# Altium project Nixie_Clock.PrjPcb
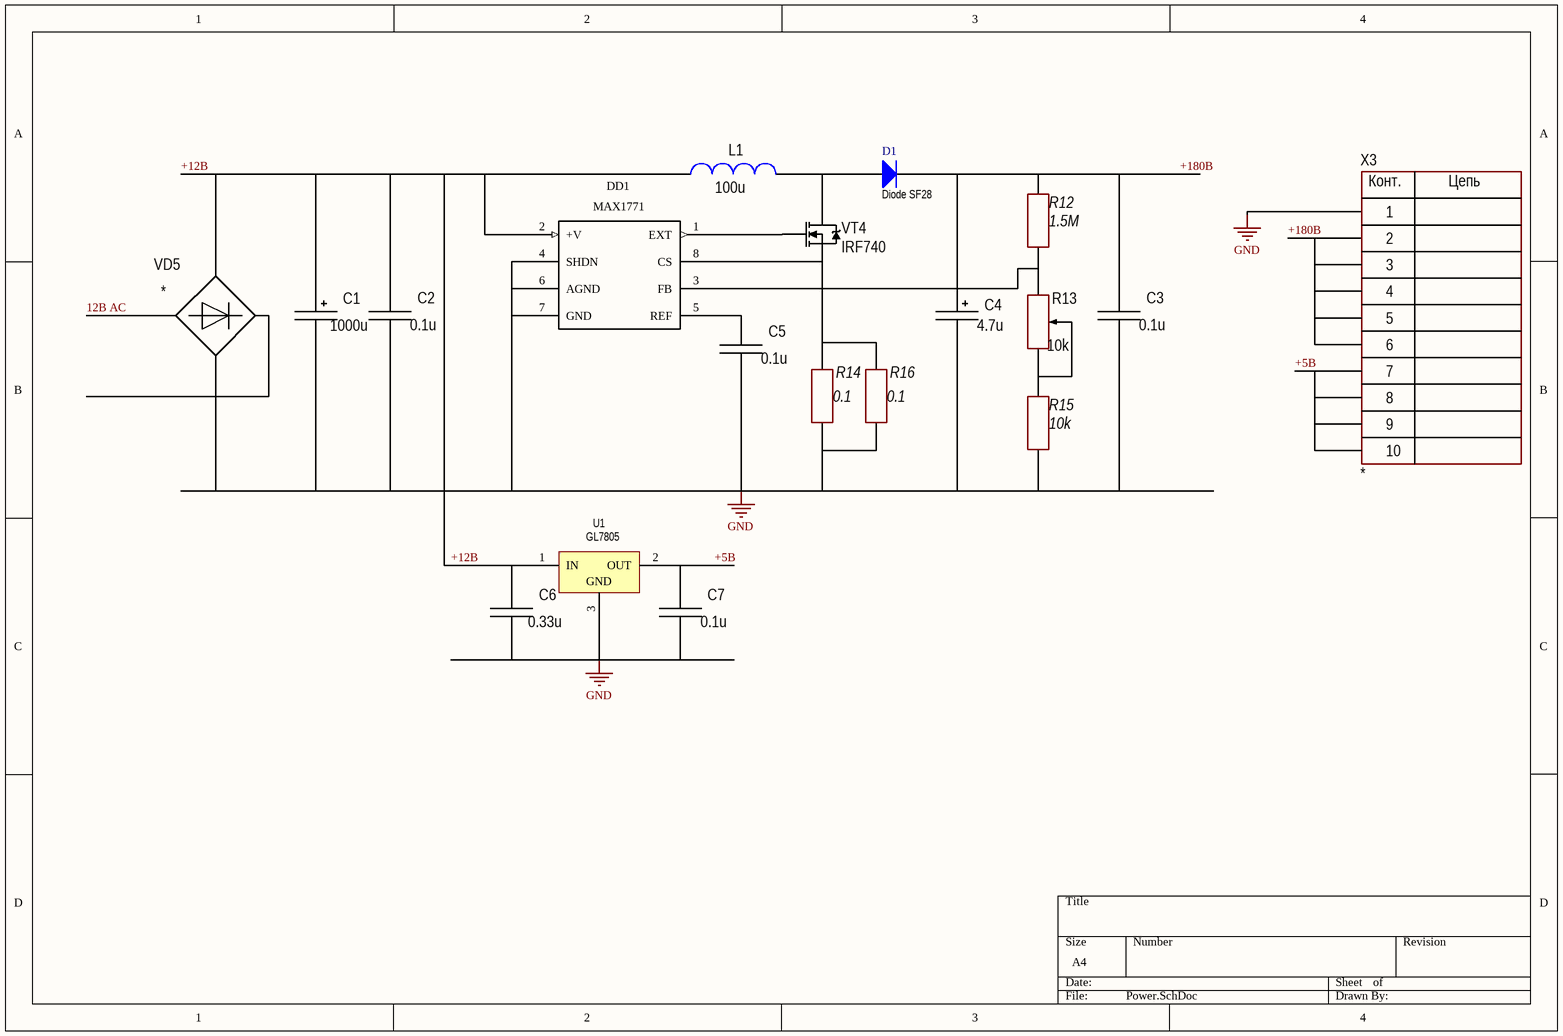
[diagram p0: Power.SchDoc]
5 sheets, 110 parts. Net scope: global (net labels, ports and power ports of the same name join across sheets).
Board files: Power.PcbDoc, Control.PcbDoc, Cross.PcbDoc, Power_2.PcbDoc, RGB_plate.PcbDoc, RGB_attiny2313.PcbDoc
Sheets:
  Power.SchDoc
  Control.SchDoc
  Cross.SchDoc
  Power_2.SchDoc
  RGB_attiny2313.SchDoc

## Sheet Power.SchDoc
size A4

### Parts
C1  1000u  [D5C2H11]
C2  0.1u  [CAP: DEBB33D]
C3  0.1u  [CAP: DEBB33D]
C4  4.7u  [D8C3.5H12]
C5  0.1u  [CAP: DEBB33D]
C6  0.33u  [CAP: DEBB33D]
C7  0.1u  [CAP: DEBB33D]
D1  Diode SF28  [DO-201AD]
DD1  MAX1771  [MAX1771_DIP8 - duplicate]
L1  100u  [IND: SRU1048]
R12  1.5M  [MLT]
R13  10k  [RES: 3296W]
R14  0.1  [MLT]
R15  10k  [MLT]
R16  0.1  [MLT]
U1  GL7805  [TO220VW]
VD5  *  [DIOD: DF206S-G]
VT4  IRF740  [TO220_123_H]
X3  *  [CON: S10B-PHD]

### Nets
GND: C1.2 C2.2 C3.2 C4.2 C5.2 C6.2 C7.2 DD1.4(SHDN) DD1.6(AGND) DD1.7(GND) R14.1 R15.2 R16.1 U1.3(GND) VD5.4 X3.1
12В AC: VD5.1
+5В: C7.1 U1.2(OUT) X3.7 X3.8 X3.9 X3.10
+12В: C1.1 C2.1 C6.1 DD1.2(+V) L1.2 U1.1(IN) VD5.2
+180В: C3.1 C4.1 D1.2(K) R12.1 X3.2 X3.3 X3.4 X3.5 X3.6
NetC5_1: C5.1 DD1.5(REF)
NetD1_1: D1.1(A) L1.1 VT4.2(D)
NetDD1_1: DD1.1(EXT) VT4.1(G)
NetDD1_3: DD1.3(FB) R12.2 R13.1
NetDD1_8: DD1.8(CS) R14.2 R16.2 VT4.3(S)
NetR13_2: R13.2 R13.3 R15.1

Not connected (* = marked no-connect by the designer): VD5 3

### Notes on the sheet
- (in symbol 10-Connector) Конт.; Цепь

### Library data of the parts
C1 C4 = AlumCap: Manufacturer: *; Model: *; HelpURL: *; ComponentKind: *; Value: *
C2 C3 C5-C7 = Capacitor: Manufacturer: *; Model: *; HelpURL: *; ComponentKind: *; Value: *
D1 = Diode 1N5402: 3 Amp General Purpose Rectifier; Published: 8-Jun-2000; LatestRevisionDate: 17-Jul-2002; LatestRevisionNote: Re-released for DXP Platform.; DatasheetVersion: 1998; PackageVersion: Aug-1999; PackageReference: DO-201AD; Publisher: Altium Limited; PackageDescription: Diode, Axial; Body 9.5 x 5.6 mm (LxDia. max), Lead Dia. 1.32 mm (max); ComponentLink1Description: Manufacturer Link; ComponentLink1URL: http://www.fairchildsemi.com/; ComponentLink2Description: Datasheet; ComponentLink2URL: http://www.fairchildsemi.com/ds/1N%2F1N5400.pdf
L1 = Inductor: Manufacturer: *; Model: *; HelpURL: *; ComponentKind: *; Value: *
R12 R14-R16 = Resistor: MLT; Model: *; Manufacture: *; HelpURL: *; Case: *; Value: *
R13 = ADJ resistor: Manufacturer: *; Model: *; HelpURL: *; ComponentKind: *; Value: *
U1 = L78S05CV: 2A Positive Voltage Regulator; Note: Tab is connected to pin 3 (GND).; Published: 24-Aug-2001; LatestRevisionDate: 17-Jul-2002; LatestRevisionNote: Re-released for DXP Platform.; DatasheetVersion: Jan-1993; PackageVersion: Apr-1998; PackageReference: TO220VW; Publisher: Altium Limited; PackageDescription: TO, Thru-Hole, Vertical, Heatsink Mounted; 3 In-Line Leads; Pitch 2.54 mm; Pin sequence 1, 3, 2; ComponentLink1Description: Manufacturer Link; ComponentLink1URL: http://www.st.com/; ComponentLink2Description: Datasheet; ComponentLink2URL: http://www.st.com/stonline/products/literature/ds/2148/l78s10c.pdf
VD5 = Bridge: ComponentKind: *; Manufacturer: *; Model: *; HelpURL: *
VT4 = N-chanel: Mosfet; Model: *; Manufacturer: *; ComponentKind: *; HelpURL: *
X3 = 10-Connector: Model: *; Manufacturer: *; HelpURL: *; ComponentKind: *

## Sheet Control.SchDoc
size A4
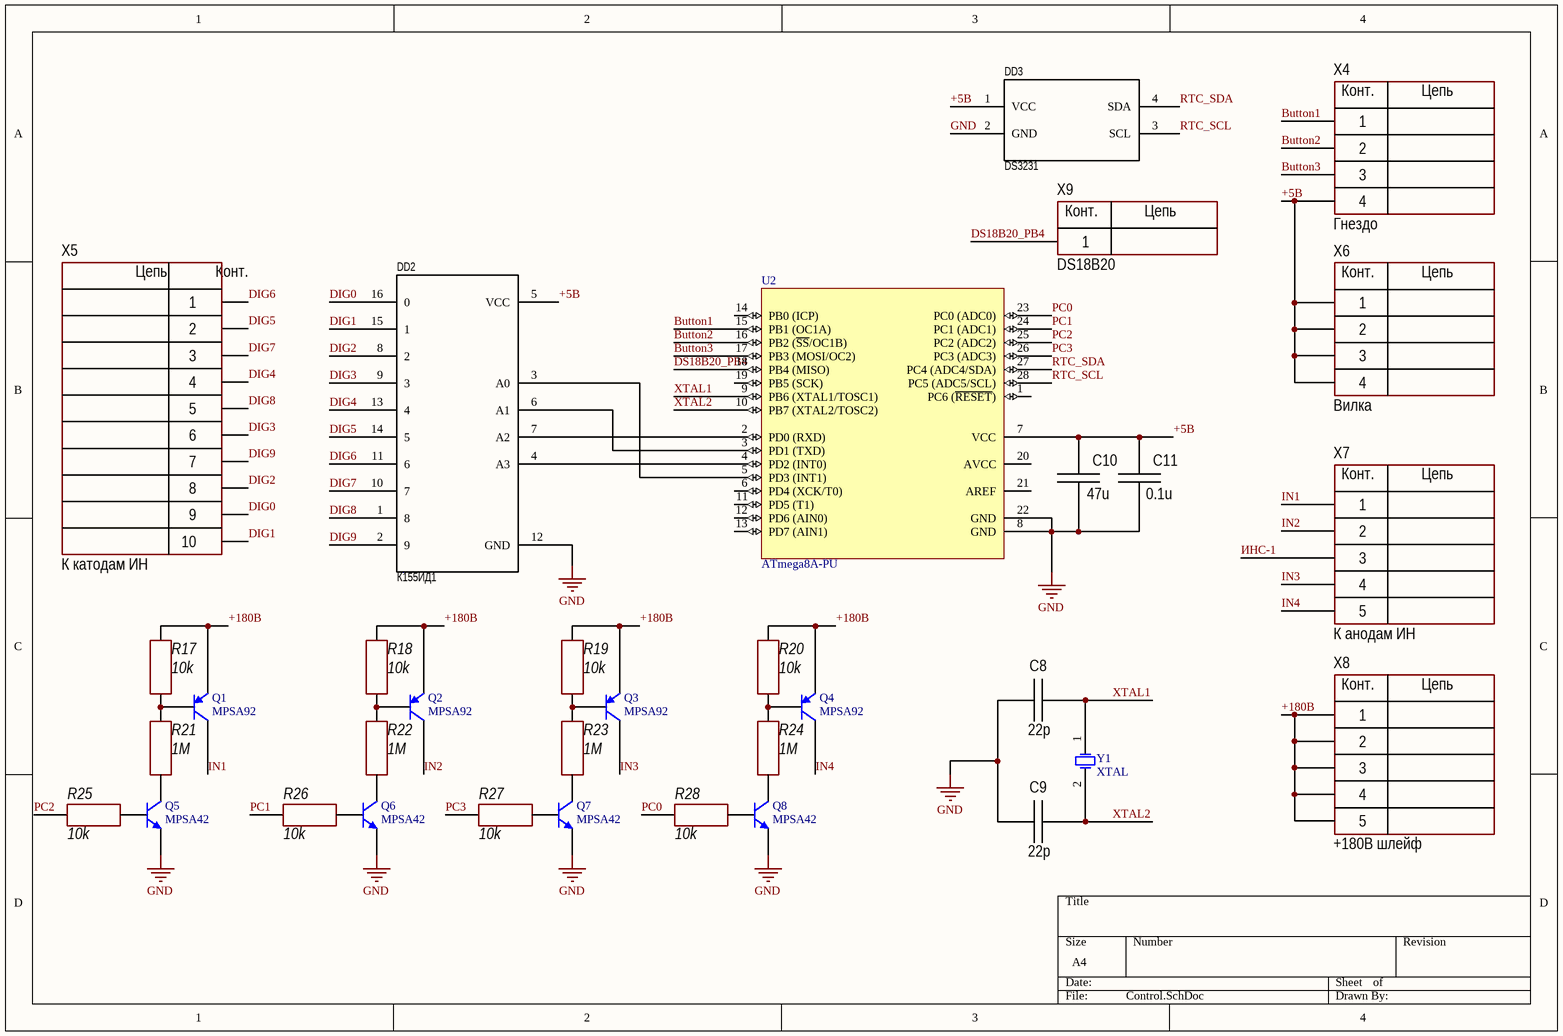
[diagram p1: Control.SchDoc]

### Parts
C8  22p  [CAP: DEBB33D]
C9  22p  [CAP: DEBB33D]
C10  47u  [CAP: DEBB33D]
C11  0.1u  [CAP: DEBB33D]
DD2  К155ИД1  [DIP16]
DD3  DS3231  [DS3231]
Q1  MPSA92  [TO-92A]
Q2  MPSA92  [TO-92A]
Q3  MPSA92  [TO-92A]
Q4  MPSA92  [TO-92A]
Q5  MPSA42  [TO-92A]
Q6  MPSA42  [TO-92A]
Q7  MPSA42  [TO-92A]
Q8  MPSA42  [TO-92A]
R17  10k  [MLT]
R18  10k  [MLT]
R19  10k  [MLT]
R20  10k  [MLT]
R21  1M  [MLT]
R22  1M  [MLT]
R23  1M  [MLT]
R24  1M  [MLT]
R25  10k  [MLT]
R26  10k  [MLT]
R27  10k  [MLT]
R28  10k  [MLT]
U2  ATmega8A-PU  [28P3]
X4  Гнездо  [CON: PBS-4]
X5  К катодам ИН  [CON: PBS-10]
X6  Вилка  [CON: PLS-4]
X7  К анодам ИН  [CON: PBS-5]
X8  +180В шлейф  [CON: PBS-5]
X9  DS18B20  [CON: PADS 1x1mm]
Y1  XTAL  [R38]

### Nets
GND: C8.1 C9.1 C10.2 C11.2 DD2.12(GND) DD3.2(GND) Q5.1(E) Q6.1(E) Q7.1(E) Q8.1(E) U2.8(GND) U2.22(GND)
+5В: C10.1 C11.1 DD2.5(VCC) DD3.1(VCC) U2.7(VCC) X4.4 X6.1 X6.2 X6.3 X6.4
+180В: Q1.1(E) Q2.1(E) Q3.1(E) Q4.1(E) R17.2 R18.2 R19.2 R20.2 X8.1 X8.2 X8.3 X8.4 X8.5
Button1: U2.15(PB1_(OC1A)) X4.1
Button2: U2.16(PB2_(~{SS}/OC1B)) X4.2
Button3: U2.17(PB3_(MOSI/OC2)) X4.3
DIG0: DD2.16(0) X5.9
DIG1: DD2.15(1) X5.10
DIG2: DD2.8(2) X5.8
DIG3: DD2.9(3) X5.6
DIG4: DD2.13(4) X5.4
DIG5: DD2.14(5) X5.2
DIG6: DD2.11(6) X5.1
DIG7: DD2.10(7) X5.3
DIG8: DD2.1(8) X5.5
DIG9: DD2.2(9) X5.7
DS18B20_PB4: U2.18(PB4_(MISO)) X9.1
IN1: Q1.3(C) X7.1
IN2: Q2.3(C) X7.2
IN3: Q3.3(C) X7.4
IN4: Q4.3(C) X7.5
PC0: R28.2 U2.23(PC0_(ADC0))
PC1: R26.2 U2.24(PC1_(ADC1))
PC2: R25.2 U2.25(PC2_(ADC2))
PC3: R27.2 U2.26(PC3_(ADC3))
RTC_SCL: DD3.3(SCL) U2.28(PC5_(ADC5/SCL))
RTC_SDA: DD3.4(SDA) U2.27(PC4_(ADC4/SDA))
XTAL1: C8.2 U2.9(PB6_(XTAL1/TOSC1)) Y1.1(OSC1)
XTAL2: C9.2 U2.10(PB7_(XTAL2/TOSC2)) Y1.2(OSC2)
ИНС-1: X7.3
NetDD2_3: DD2.3(A0) U2.5(PD3_(INT1))
NetDD2_4: DD2.4(A3) U2.4(PD2_(INT0))
NetDD2_6: DD2.6(A1) U2.3(PD1_(TXD))
NetDD2_7: DD2.7(A2) U2.2(PD0_(RXD))
NetQ1_2: Q1.2(B) R17.1 R21.2
NetQ2_2: Q2.2(B) R18.1 R22.2
NetQ3_2: Q3.2(B) R19.1 R23.2
NetQ4_2: Q4.2(B) R20.1 R24.2
NetQ5_2: Q5.2(B) R25.1
NetQ5_3: Q5.3(C) R21.1
NetQ6_2: Q6.2(B) R26.1
NetQ6_3: Q6.3(C) R22.1
NetQ7_2: Q7.2(B) R27.1
NetQ7_3: Q7.3(C) R23.1
NetQ8_2: Q8.2(B) R28.1
NetQ8_3: Q8.3(C) R24.1

Not connected (* = marked no-connect by the designer): U2 1(PC6_(~{RESET})) 6(PD4_(XCK/T0)) 11(PD5_(T1)) 12(PD6_(AIN0)) 13(PD7_(AIN1)) 14(PB0_(ICP)) 19(PB5_(SCK)) 20(AVCC) 21(AREF)

### Notes on the sheet
- (in symbol 1-Connector) Конт.; Цепь
- (in symbol 4-Connector) Конт.; Цепь
- (in symbol 5-Connector) Конт.; Цепь
- (in symbol 10-Connector) Цепь; Конт.

### Library data of the parts
C8-C11 = Capacitor: Manufacturer: *; Model: *; HelpURL: *; ComponentKind: *; Value: *
DD2 = K155ID1
Q1-Q4 = 2N3906: PNP General Purpose Amplifier; Published: 8-Jun-2000; LatestRevisionDate: 15-Jan-2003; LatestRevisionNote: PCB Footprint 'BCY-W3/D4.7' replaced; DatasheetVersion: 1997; PackageVersion: Sep-1998; PackageReference: TO-92A; Publisher: Altium Limited; PackageDescription: TO, Flat Index; 3 In-Line, Axial Leads; Body Dia. 4.5mm; Leads 0.51 x 0.48 mm (max); ComponentLink1Description: Manufacturer Link; ComponentLink1URL: http://www.fairchildsemi.com/; ComponentLink2Description: Datasheet; ComponentLink2URL: http://www.fairchildsemi.com/ds/2N%2F2N3906.pdf
Q5-Q8 = 2N3904: NPN General Purpose Amplifier; Published: 8-Jun-2000; LatestRevisionDate: 15-Jan-2003; LatestRevisionNote: PCB Footprint 'BCY-W3/D4.7' replaced; DatasheetVersion: 1997; PackageVersion: Sep-1998; PackageReference: TO-92A; Publisher: Altium Limited; PackageDescription: TO, Flat Index; 3 In-Line, Axial Leads; Body Dia. 4.5mm; Leads 0.51 x 0.48 mm (max); ComponentLink1Description: Manufacturer Link; ComponentLink1URL: http://www.fairchildsemi.com/; ComponentLink2Description: Datasheet; ComponentLink2URL: http://www.fairchildsemi.com/ds/2N%2F2N3904.pdf
R17-R28 = Resistor: MLT; Model: *; Manufacture: *; HelpURL: *; Case: *; Value: *
U2 = ATmega8A-PU: 8-bit AVR Microcontroller, 8KB Flash, 512 Bytes EEPROM, 1KB SRAM, 28-pin PDIP, Industrial Grade (-40°C to 85°C); Published: 1-Apr-2010; DatasheetVersion: revC, Jul-2009; PackageVersion: revB, Sep-2001; PackageReference: 28P3; Publisher: Altium Limited; PackageDescription: 28-lead (0.300"/7.62mm Wide) Plastic Dual Inline Package (PDIP); Supplier 1: Digi-Key; Supplier Part Number 1: ATMEGA8A-PU-ND; Supplier 2: Farnell; Supplier Part Number 2: 1748534; Supplier 3: Mouser; Supplier Part Number 3: 556-ATMEGA8A-PU; ComponentLink1Description: Manufacturer Link; ComponentLink1URL: http://www.atmel.com/products/avr/default.asp?; ComponentLink2Description: ATmega8A Datasheet; ComponentLink2URL: http://www.atmel.com/dyn/resources/prod_documents/doc8159.pdf; ComponentLink3Description: ATmega8A Summary; ComponentLink3URL: http://www.atmel.com/dyn/resources/prod_documents/8159S.pdf; ComponentLink4Description: Atmel.com Home; ComponentLink4URL: http://www.atmel.com
X4 X6 = 4-Connector: Model: *; Manufacturer: *; HelpURL: *; ComponentKind: *
X5 = 10-Connector: Model: *; Manufacturer: *; HelpURL: *; ComponentKind: *
X7 X8 = 5-Connector: Model: *; Manufacturer: *; HelpURL: *; ComponentKind: *
X9 = 1-Connector: Model: *; Manufacturer: *; HelpURL: *; ComponentKind: *
Y1 = XTAL: Crystal Oscillator; Published: 8-Jun-2000; LatestRevisionDate: 17-Jul-2002; LatestRevisionNote: Re-released for DXP Platform.; PackageReference: R38; Publisher: Altium Limited; PackageDescription: Crystal, Thru-Hole; 2 Leads; Body 3.1 x 8.2 mm (Dia.xH)

## Sheet Cross.SchDoc
size A4
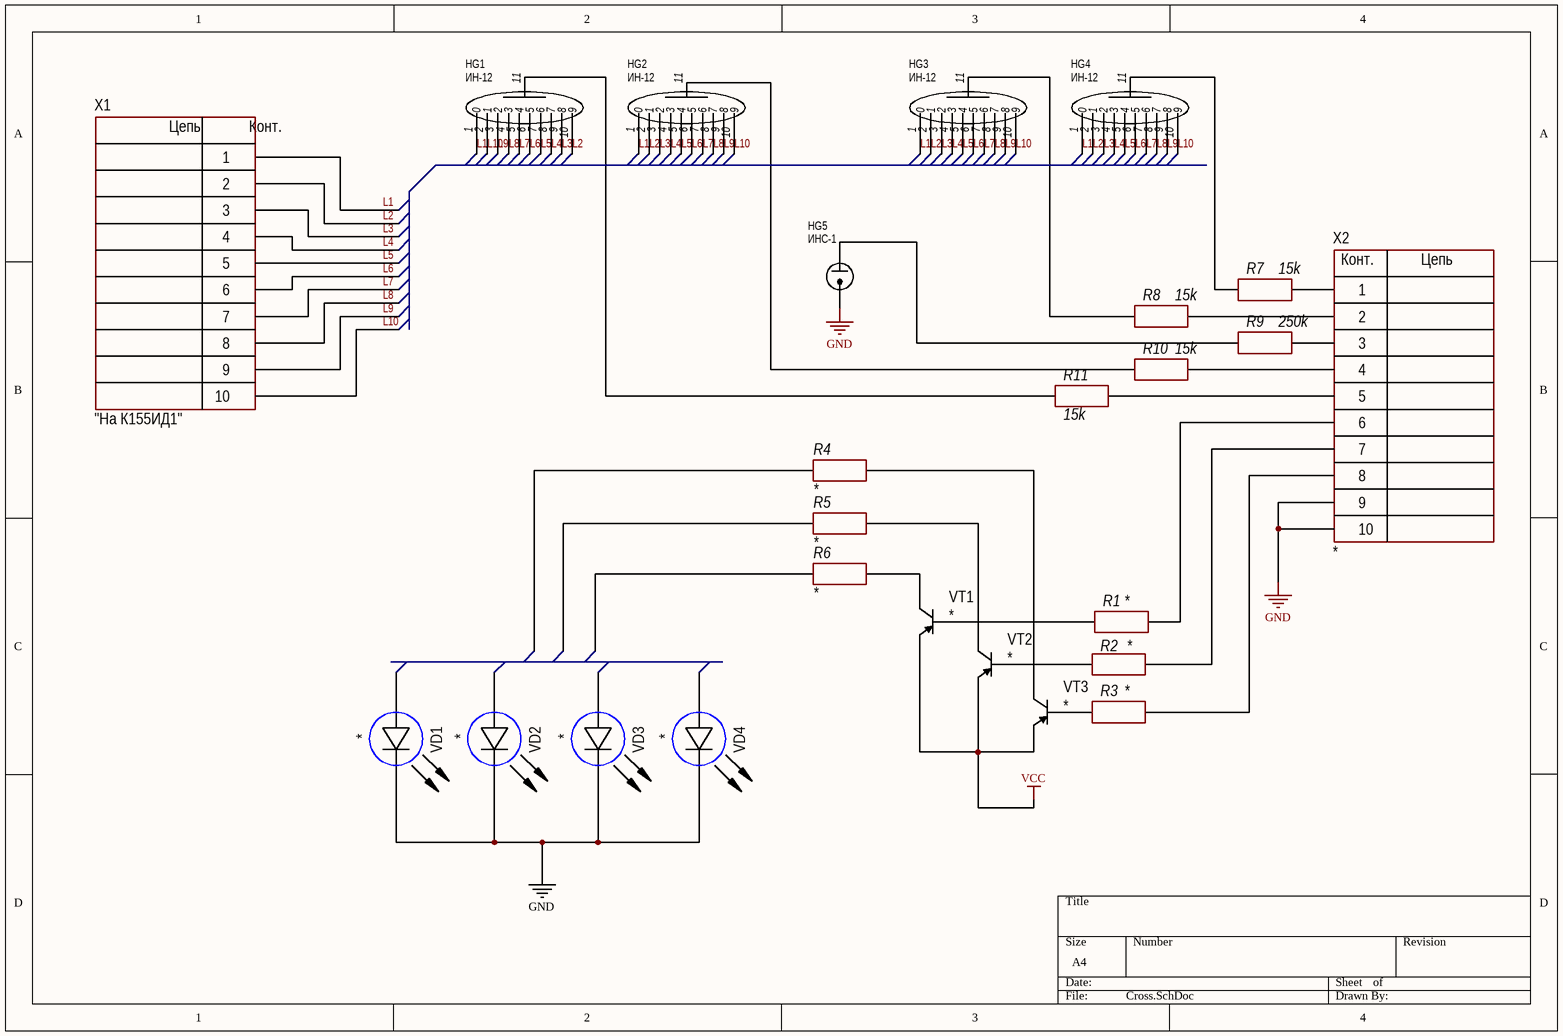
[diagram p2: Cross.SchDoc]

### Parts
HG1  ИН-12  [PCBComponent_1]
HG2  ИН-12  [PCBComponent_1]
HG3  ИН-12  [PCBComponent_1]
HG4  ИН-12  [PCBComponent_1]
HG5  ИНС-1  [ИНС-1]
R1  *  [MLT]
R2  *  [MLT]
R3  *  [MLT]
R4  *  [MLT]
R5  *  [MLT]
R6  *  [MLT]
R7  15k  [MLT]
R8  15k  [MLT]
R9  250k  [MLT]
R10  15k  [MLT]
R11  15k  [MLT]
VD1  *  [CH1206LY]
VD2  *  [CH1206LY]
VD3  *  [CH1206LY]
VD4  *  [CH1206LY]
VT1  *  [TO220_123]
VT2  *  [TO220_123]
VT3  *  [TO220_123]
X1  "На К155ИД1"  [CON: PLS-10]
X2  *  [CON: PLS-10]

### Nets
GND: HG5.1 VD1.2(C) VD2.2(C) VD3.2(C) VD4.2(C) X2.9 X2.10
VCC: VT1.2(E) VT2.2(E) VT3.2(E)
L1: HG1.1(0) HG2.1(0) HG3.1(0) HG4.1(0) X1.1
L2: HG1.10(9) HG2.2(1) HG3.2(1) HG4.2(1) X1.2
L3: HG1.9(8) HG2.3(2) HG3.3(2) HG4.3(2) X1.3
L4: HG1.8(7) HG2.4(3) HG3.4(3) HG4.4(3) X1.4
L5: HG1.7(6) HG2.5(4) HG3.5(4) HG4.5(4) X1.5
L6: HG1.6(5) HG2.6(5) HG3.6(5) HG4.6(5) X1.6
L7: HG1.5(4) HG2.7(6) HG3.7(6) HG4.7(6) X1.7
L8: HG1.4(3) HG2.8(7) HG3.8(7) HG4.8(7) X1.8
L9: HG1.3(2) HG2.9(8) HG3.9(8) HG4.9(8) X1.9
L10: HG1.2(1) HG2.10(9) HG3.10(9) HG4.10(9) X1.10
NetHG1_11: HG1.11 R11.1
NetHG2_11: HG2.11 R10.1
NetHG3_11: HG3.11 R8.1
NetHG4_11: HG4.11 R7.1
NetHG5_2: HG5.2 R9.1
NetR1_1: R1.1 VT1.1(B)
NetR1_2: R1.2 X2.6
NetR2_1: R2.1 VT2.1(B)
NetR2_2: R2.2 X2.7
NetR3_1: R3.1 VT3.1(B)
NetR3_2: R3.2 X2.8
NetR4_2: R4.2 VT3.3(C)
NetR5_2: R5.2 VT2.3(C)
NetR6_2: R6.2 VT1.3(C)
NetR7_2: R7.2 X2.1
NetR8_2: R8.2 X2.2
NetR9_2: R9.2 X2.3
NetR10_2: R10.2 X2.4
NetR11_2: R11.2 X2.5

Not connected (* = marked no-connect by the designer): R4 1; R5 1; R6 1; VD1 1(A); VD2 1(A); VD3 1(A); VD4 1(A)

### Notes on the sheet
- (in symbol 10-Connector) Цепь; Конт.

### Library data of the parts
HG1-HG4 = IN-12: Model: *; Manufacture: *; HelpURL: *; Case: *
R1-R8 R10 R11 = Resistor: MLT; Model: *; Manufacture: *; HelpURL: *; Case: *
  R1-R6: Value: *
  R7 R8 R10 R11: Value: 15k
R9 = Resistor: MLT; Value: 15k; Model: *; Manufacture: *; HelpURL: *; Case: *
VD1-VD4 = LED: Manufacturer: *; Model: *; HelpURL: *; ComponentKind: *; Value: *
VT1-VT3 = PNP: Bipolar; Model: *; Manufacturer: *; ComponentKind: *; HelpURL: *
X1 X2 = 10-Connector: Model: *; Manufacturer: *; HelpURL: *; ComponentKind: *

## Sheet Power_2.SchDoc
size A4
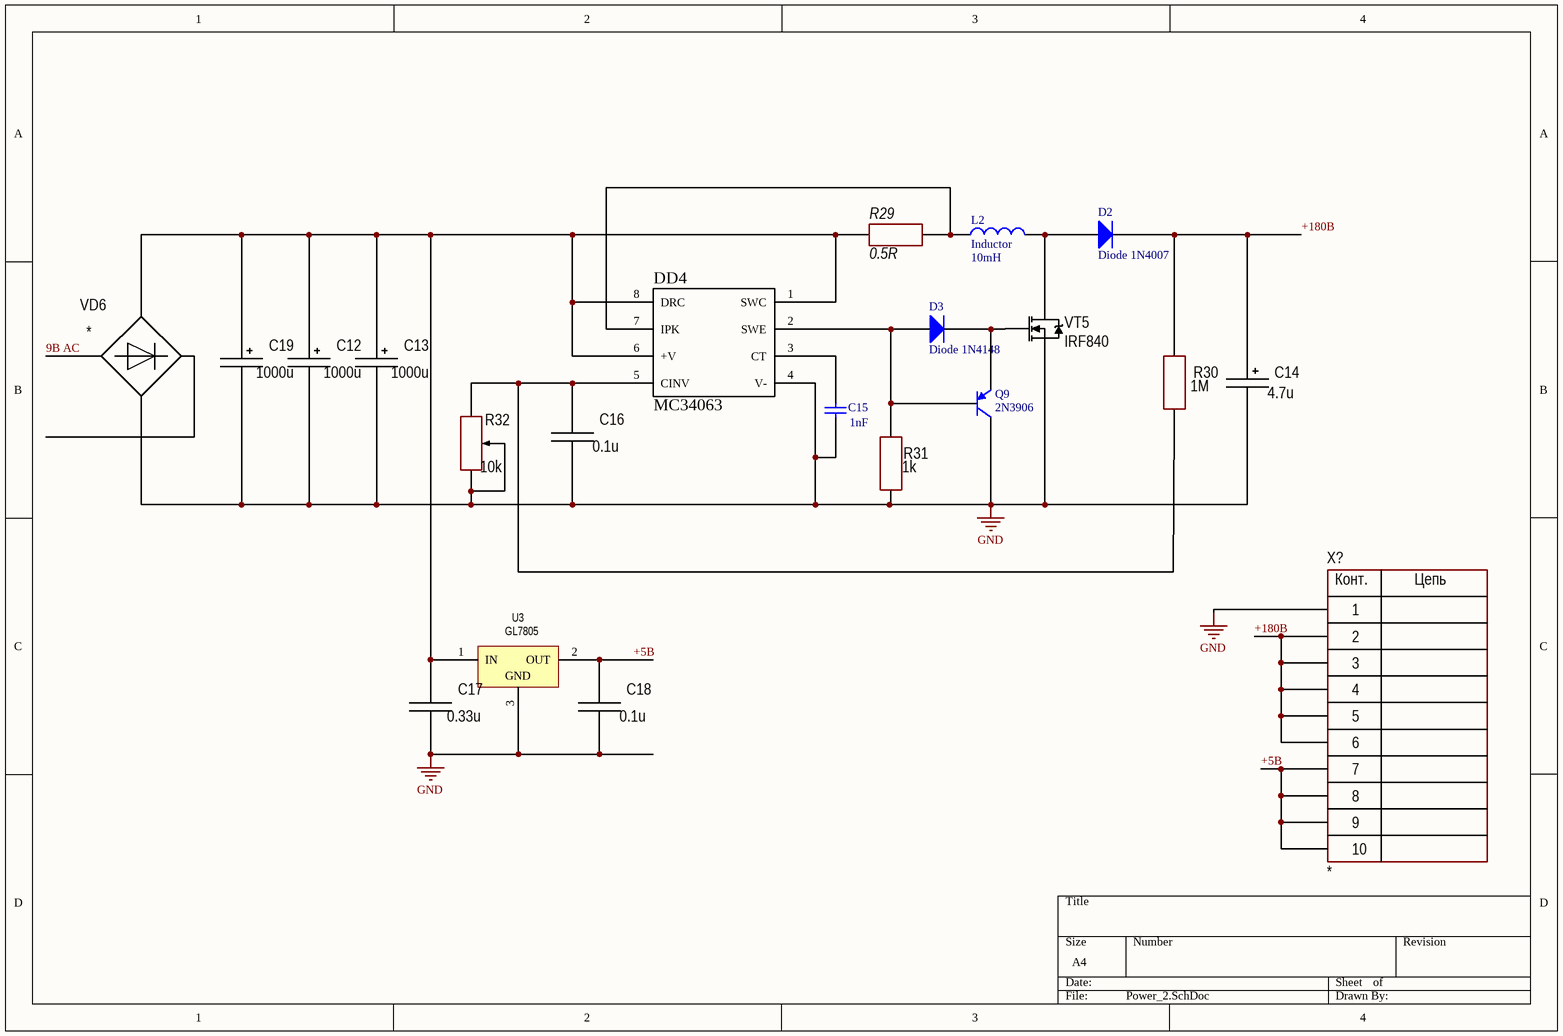
[diagram p3: Power_2.SchDoc]

### Parts
C12  1000u  [D5C2H11]
C13  1000u  [D5C2H11]
C14  4.7u  [D8C3.5H12]
C15  value 1nF  [C1206]  (hidden comment: Cap)
C16  0.1u  [CAP: DEBB33D]
C17  0.33u  [CAP: DEBB33D]
C18  0.1u  [CAP: DEBB33D]
C19  1000u  [D5C2H11]
D2  Diode 1N4007  [DO-41]
D3  Diode 1N4148  [DO-35]
DD4  MC34063  [MAX1771_DIP8 - duplicate]
L2  Inductor  value 10mH  [Ferrite_ring]
Q9  2N3906  [TO-92A]
R29  0.5R  [MLT]
R30  1M  [CH1206R]
R31  1k  [CH1206R]
R32  10k  [RES: 3296W]
U3  GL7805  [TO220VW]
VD6  *  [DIOD: DF206S-G]
VT5  IRF840  [DPAK]
X?  *  [CON: S10B-PHD]

### Nets
GND: C12.2 C13.2 C14.2 C15.1 C16.2 C17.2 C18.2 C19.2 DD4.4(V-) Q9.3(C) R31.2 R32.2 R32.3 U3.3(GND) VD6.4 VT5.3(S) X?.1
9В AC: VD6.1
+5В: C18.1 U3.2(OUT) X?.7 X?.8 X?.9 X?.10
+180В: C14.1 D2.2(K) R30.1 X?.2 X?.3 X?.4 X?.5 X?.6
NetC12_1: C12.1 C13.1 C17.1 C19.1 DD4.1(SWC) DD4.6(+V) DD4.8(DRC) R29.1 U3.1(IN) VD6.2
NetC15_2: C15.2 DD4.3(CT)
NetC16_1: C16.1 DD4.5(CINV) R30.2 R32.1
NetD2_1: D2.1(A) L2.2 VT5.2(D)
NetD3_1: D3.1(A) DD4.2(SWE) Q9.2(B) R31.1
NetD3_2: D3.2(K) Q9.1(E) VT5.1(G)
NetDD4_7: DD4.7(IPK) L2.1 R29.2

Not connected (* = marked no-connect by the designer): VD6 3

### Notes on the sheet
- (in symbol 10-Connector) Конт.; Цепь

### Library data of the parts
C12-C14 C19 = AlumCap: Manufacturer: *; Model: *; HelpURL: *; ComponentKind: *; Value: *
C15 = Cap Semi: Capacitor (Semiconductor SIM Model); Published: 8-Jun-2000; LatestRevisionDate: 29-May-2009; LatestRevisionNote: IPC-7351 Footprint Added.; PackageReference: C1206; Publisher: Altium Limited; PackageDescription: Chip Capacitor
C16-C18 = Capacitor: Manufacturer: *; Model: *; HelpURL: *; ComponentKind: *; Value: *
D2 = Diode 1N4007: 1 Amp General Purpose Rectifier; Published: 8-Jun-2000; LatestRevisionDate: 17-Jul-2002; LatestRevisionNote: Re-released for DXP Platform.; DatasheetVersion: 1998; PackageVersion: Aug-1999; PackageReference: DO-41; Publisher: Altium Limited; PackageDescription: Diode, Axial; Body 5.2 x 2.7 mm (LxDia. max), Lead Dia. 0.86 mm (max); Code_JEDEC: DO-204-AL; ComponentLink1Description: Manufacturer Link; ComponentLink1URL: http://www.fairchildsemi.com/; ComponentLink2Description: Datasheet; ComponentLink2URL: http://www.fairchildsemi.com/ds/1N%2F1N4001.pdf
D3 = Diode 1N4148: High Conductance Fast Diode; Published: 8-Jun-2000; LatestRevisionDate: 17-Jul-2002; LatestRevisionNote: Re-released for DXP Platform.; DatasheetVersion: 1997; PackageReference: DO-35; Publisher: Altium Limited; PackageDescription: Diode, Axial; Body 3.8 x 1.9 mm (LxDia. max), Lead Dia. 0.53 mm (max); Code_JEDEC: DO-204-AH; ComponentLink1Description: Manufacturer Link; ComponentLink1URL: http://www.fairchildsemi.com/; ComponentLink2Description: Datasheet; ComponentLink2URL: http://www.fairchildsemi.com/ds/1N%2F1N4148.pdf
L2 = Inductor: Code_IEC: 1005; Published: 8-Jun-2000; LatestRevisionDate: 29-May-2009; LatestRevisionNote: IPC-7351 Footprint Added.; PackageReference: 0402-A; Publisher: Altium Limited; PackageDescription: Chip Inductor; Code_JEITA: 0402
Q9 = 2N3906: PNP General Purpose Amplifier; Published: 8-Jun-2000; LatestRevisionDate: 15-Jan-2003; LatestRevisionNote: PCB Footprint 'BCY-W3/D4.7' replaced; DatasheetVersion: 1997; PackageVersion: Sep-1998; PackageReference: TO-92A; Publisher: Altium Limited; PackageDescription: TO, Flat Index; 3 In-Line, Axial Leads; Body Dia. 4.5mm; Leads 0.51 x 0.48 mm (max); ComponentLink1Description: Manufacturer Link; ComponentLink1URL: http://www.fairchildsemi.com/; ComponentLink2Description: Datasheet; ComponentLink2URL: http://www.fairchildsemi.com/ds/2N%2F2N3906.pdf
R29 = Resistor: MLT; Model: *; Manufacture: *; HelpURL: *; Case: *; Value: *
R30 R31 = Resistor: Manufacturer: *; Model: *; HelpURL: *; ComponentKind: *; Value: *
R32 = ADJ resistor: Manufacturer: *; Model: *; HelpURL: *; ComponentKind: *; Value: *
U3 = L78S05CV: as U1 on sheet Power; Published: 24-Aug-2001; LatestRevisionDate: 17-Jul-2002; LatestRevisionNote: Re-released for DXP Platform.; DatasheetVersion: Jan-1993; PackageVersion: Apr-1998; PackageReference: TO220VW; Publisher: Altium Limited; PackageDescription: TO, Thru-Hole, Vertical, Heatsink Mounted; 3 In-Line Leads; Pitch 2.54 mm; Pin sequence 1, 3, 2; ComponentLink1Description: Manufacturer Link; ComponentLink1URL: http://www.st.com/; ComponentLink2Description: Datasheet; ComponentLink2URL: http://www.st.com/stonline/products/literature/ds/2148/l78s10c.pdf
VD6 = Bridge: ComponentKind: *; Manufacturer: *; Model: *; HelpURL: *
VT5 = N-chanel: Mosfet; Model: *; Manufacturer: *; ComponentKind: *; HelpURL: *
X? = 10-Connector: Model: *; Manufacturer: *; HelpURL: *; ComponentKind: *

## Sheet RGB_attiny2313.SchDoc
size A4
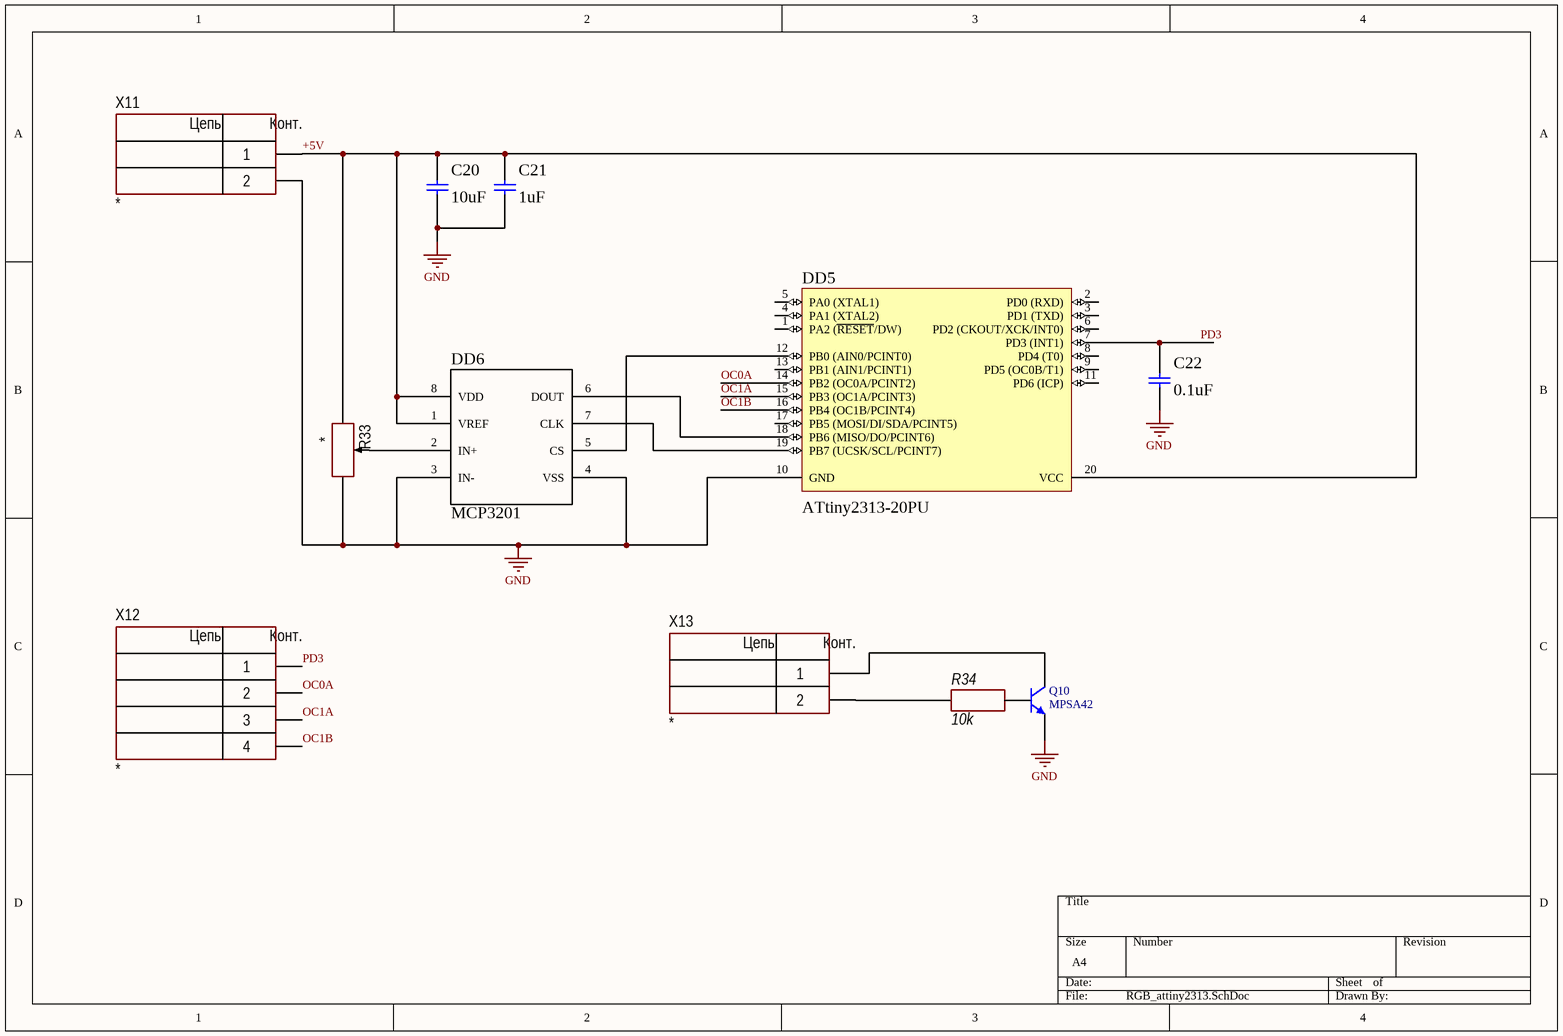
[diagram p4: RGB_attiny2313.SchDoc]

### Parts
C20  value 10uF  [C1206]  (hidden comment: Cap Semi)
C21  value 1uF  [C1206]  (hidden comment: Cap Semi)
C22  value 0.1uF  [C1206]  (hidden comment: Cap Semi)
DD5  ATtiny2313-20PU  [20P3]
DD6  MCP3201  [MAX1771_DIP8 - duplicate]
Q10  MPSA42  [TO-92A]
R33  *  [RES: 3362P]
R34  10k  [MLT]
X11  *  [CON: WJ06-02P]
X12  *  [CON: PBS-4]
X13  *  [CON: PBS-2]

### Nets
GND: C20.1 C21.1 C22.1 DD5.10(GND) DD6.3(IN-) DD6.4(VSS) Q10.1(E) R33.3 X11.2
+5V: C20.2 C21.2 DD5.20(VCC) DD6.1(VREF) DD6.8(VDD) R33.1 X11.1
OC0A: DD5.14(PB2_(OC0A/PCINT2)) X12.2
OC1A: DD5.15(PB3_(OC1A/PCINT3)) X12.3
OC1B: DD5.16(PB4_(OC1B/PCINT4)) X12.4
PD3: C22.2 DD5.7(PD3_(INT1)) X12.1
NetDD5_12: DD5.12(PB0_(AIN0/PCINT0)) DD6.5(CS)
NetDD5_18: DD5.18(PB6_(MISO/DO/PCINT6)) DD6.6(DOUT)
NetDD5_19: DD5.19(PB7_(UCSK/SCL/PCINT7)) DD6.7(CLK)
NetDD6_2: DD6.2(IN+) R33.2
NetQ10_2: Q10.2(B) R34.1
NetQ10_3: Q10.3(C) X13.1
NetR34_2: R34.2 X13.2

Not connected (* = marked no-connect by the designer): DD5 1(PA2_(~{RESET}/DW)) 2(PD0_(RXD)) 3(PD1_(TXD)) 4(PA1_(XTAL2)) 5(PA0_(XTAL1)) 6(PD2_(CKOUT/XCK/INT0)) 8(PD4_(T0)) 9(PD5_(OC0B/T1)) 11(PD6_(ICP)) 13(PB1_(AIN1/PCINT1)) 17(PB5_(MOSI/DI/SDA/PCINT5))

### Notes on the sheet
- (in symbol 2-Connector) Цепь; Конт.
- (in symbol 4-Connector) Цепь; Конт.

### Library data of the parts
C20-C22 = Cap Semi: Capacitor (Semiconductor SIM Model); Published: 8-Jun-2000; LatestRevisionDate: 29-May-2009; LatestRevisionNote: IPC-7351 Footprint Added.; PackageReference: C1206; Publisher: Altium Limited; PackageDescription: Chip Capacitor
DD5 = ATtiny2313-20PU: Low Power tinyAVR® 8-Bit Microcontroller, 2K Flash Memory, 20MHz, Industrial Temperature, 20-Lead PDIP, Pb-Free; Published: 20-Nov-2009; DatasheetVersion: DOC2543B, Mar-2009; PackageVersion: revC, Jan-2004; PackageReference: 20P3; Publisher: Altium Limited; PackageDescription: 20-lead (0.300"/7.62mm Wide) Plastic Dual Inline Package (PDIP); Supplier 1: Digi-Key; Supplier Part Number 1: ATTINY2313-20PU-ND; Supplier 2: Farnell; Supplier Part Number 2: 9171592; Supplier 3: Mouser; Supplier Part Number 3: 556-ATTINY2313-20PU; Code_JEDEC: MS-001-AD; ComponentLink1Description: Manufacturer Link; ComponentLink1URL: http://www.atmel.com/products/AVR/tinyavr.asp?; ComponentLink2Description: Datasheet; ComponentLink2URL: http://www.atmel.com/dyn/resources/prod_documents/doc2543.pdf; ComponentLink3Description: Atmel.com Home; ComponentLink3URL: http://www.atmel.com
Q10 = 2N3904: NPN General Purpose Amplifier; Published: 8-Jun-2000; LatestRevisionDate: 15-Jan-2003; LatestRevisionNote: PCB Footprint 'BCY-W3/D4.7' replaced; DatasheetVersion: 1997; PackageVersion: Sep-1998; PackageReference: TO-92A; Publisher: Altium Limited; PackageDescription: TO, Flat Index; 3 In-Line, Axial Leads; Body Dia. 4.5mm; Leads 0.51 x 0.48 mm (max); ComponentLink1Description: Manufacturer Link; ComponentLink1URL: http://www.fairchildsemi.com/; ComponentLink2Description: Datasheet; ComponentLink2URL: http://www.fairchildsemi.com/ds/2N%2F2N3904.pdf
R33 = ADJ resistor: Manufacturer: *; Model: *; HelpURL: *; ComponentKind: *; Value: *
R34 = Resistor: MLT; Model: *; Manufacture: *; HelpURL: *; Case: *; Value: *
X11 X13 = 2-Connector: Model: *; Manufacturer: *; HelpURL: *; ComponentKind: *
X12 = 4-Connector: Model: *; Manufacturer: *; HelpURL: *; ComponentKind: *

## Nets that join several sheets
GND: Power (16 pins), Control (12 pins), Cross (7 pins), Power_2 (17 pins), RGB_attiny2313 (9 pins)
+5В: Power (6 pins), Control (10 pins), Power_2 (6 pins)
+180В: Power (9 pins), Control (13 pins), Power_2 (8 pins)